# EAGLE design SO-8-normal (EAGLE 6.5.0)
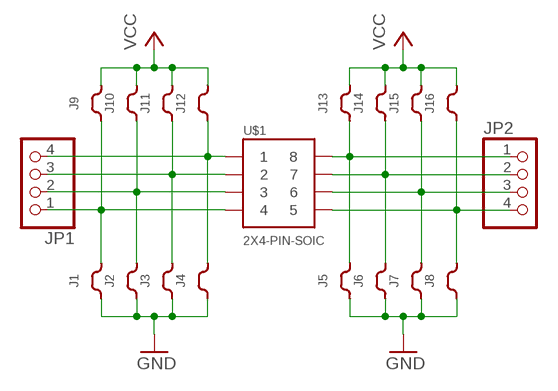
[diagram p0: schematic, sheet 1]

## Parts
J1  JUMPER-0805  [RCLJ-0805]
J2  JUMPER-0805  [RCLJ-0805]
J3  JUMPER-0805  [RCLJ-0805]
J4  JUMPER-0805  [RCLJ-0805]
J5  JUMPER-0805  [RCLJ-0805]
J6  JUMPER-0805  [RCLJ-0805]
J7  JUMPER-0805  [RCLJ-0805]
J8  JUMPER-0805  [RCLJ-0805]
J9  JUMPER-0603  [RCLJ-0603]
J10  JUMPER-0603  [RCLJ-0603]
J11  JUMPER-0603  [RCLJ-0603]
J12  JUMPER-0603  [RCLJ-0603]
J13  JUMPER-0603  [RCLJ-0603]
J14  JUMPER-0603  [RCLJ-0603]
J15  JUMPER-0603  [RCLJ-0603]
J16  JUMPER-0603  [RCLJ-0603]
JP1  PINHD-1X4  [1X04]
JP2  PINHD-1X4  [1X04]
U$1  2X4-PIN-SOIC  [SO8]

## Nets
1: J4.2 J12.1 JP1.4 U$1.P$1
2: J3.2 J11.1 JP1.3 U$1.P$2
3: J2.2 J10.1 JP1.2 U$1.P$3
4: J1.2 J9.1 JP1.1 U$1.P$4
5: J8.2 J16.1 JP2.4 U$1.P$5
6: J7.2 J15.1 JP2.3 U$1.P$6
7: J6.2 J14.1 JP2.2 U$1.P$7
8: J5.2 J13.1 JP2.1 U$1.P$8
GND: J1.1 J2.1 J3.1 J4.1 J5.1 J6.1 J7.1 J8.1
VCC: J9.2 J10.2 J11.2 J12.2 J13.2 J14.2 J15.2 J16.2

## Library data of the parts
J1-J16 = p.peter-rcl:JUMPER
JP1 JP2 = pinhead:PINHD-1X4: PIN HEADER
U$1 = p.peter-pacakages:2X4-PIN

## Board
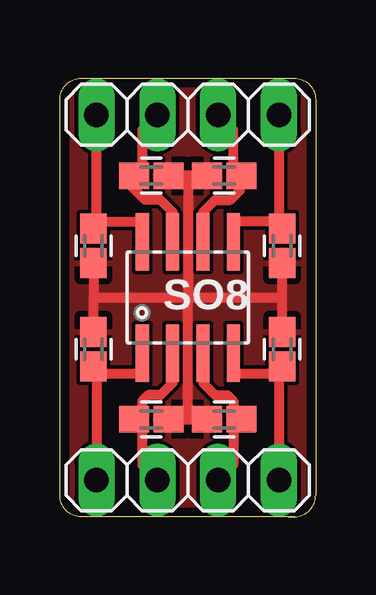
[diagram p1: board, top side]
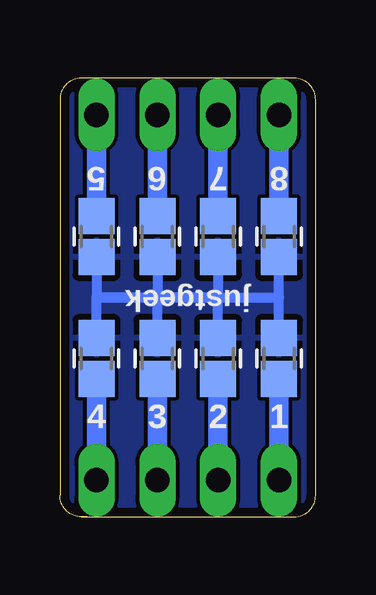
[diagram p2: board, bottom side, seen from below]

Size 10.67 x 18.29 mm. Coordinates in mm from the lower left corner, seen from the top.
Outline: 0,0.89 0,1.02
Outline: 0,1.02 0,17.4 arc-90 0.89,18.29
Outline: 0.89,18.29 1.02,18.29
Outline: 1.02,18.29 9.78,18.29 arc-90 10.67,17.4 10.67,0.89 arc-90 9.78,0
Outline: 9.78,0 9.53,0
Outline: 9.53,0 1.14,0
Outline: 1.14,0 0.89,0
Outline: 0.89,18.29 1.02,18.29
Outline: 9.53,0 9.78,0
Outline: 1.14,0 0.89,0
Outline: 0.89,0 arc-90 0,0.89
Outline: 0,0.89 0,1.02
Copper layers (1*16): Top 0.0356mm / dielectric 1.5011mm / Bottom 0.0356mm
Design rules "oshpark": minimum track width 6mil, minimum drill 13mil, track to track 6mil, track to pad 6mil, pad to pad 6mil, via to via 6mil, smd to smd 6mil, copper to edge 15mil, drill to drill 6mil, minimum pad ring 7mil, minimum via ring 7mil, stop-mask expansion 4mil, vias tented up to drill 4.1mm, thermal gap 10mil

### Footprints (pad centres in the part's own frame; a part is rotated, then mirrored left to right if it is on the bottom)
RCLJ-0805 = smd 1.5 x 1.5: 1 -0.85,0; 2 0.85,0
RCLJ-0603 = smd 1.25 x 1.1: 1 -0.725,0; 2 0.725,0
1X04 = drill 1.016 long: 1 -3.81,0; 2 -1.27,0; 3 1.27,0; 4 3.81,0
SO8 = smd 0.559 x 2.413: P$1 -1.905,-2.324; P$2 -0.635,-2.324; P$3 0.635,-2.324; P$4 1.905,-2.324; P$5 1.905,2.324; P$6 0.635,2.324; P$7 -0.635,2.324; P$8 -1.905,2.324

### Placement (x,y rotation side)
J1  9.14,6.6 270 bottom
J2  6.6,6.6 270 bottom
J3  4.06,6.6 270 bottom
J4  1.52,6.6 270 bottom
J5  1.52,11.68 90 bottom
J6  4.06,11.68 90 bottom
J7  6.6,11.68 90 bottom
J8  9.14,11.68 90 bottom
J9  9.27,6.99 90 top
J10  6.86,4.06 180 top
J11  3.81,4.06 0 top
J12  1.4,6.99 90 top
J13  1.4,11.3 270 top
J14  3.81,14.22 0 top
J15  6.86,14.22 180 top
J16  9.27,11.3 270 top
JP1  5.33,1.52 180 top
JP2  5.33,16.76 0 top
U$1  5.33,9.14 0 top

### Tracks (layer width: path | path; a pad name or v marks a point on that pad's centre or on a via)
1
  Top 0.406: J12.1 1.4,5.97 | 1.4,5.97 1.52,5.97 | 1.52,5.97 3.43,5.97 U$1.P$1 | 1.4,5.97 1.52,5.97 | 1.52,5.97 1.52,1.78 JP1.4
  Bottom 0.813: JP1.4 J4.2
2
  Top 0.406: J11.1 3.43,4.06 3.43,3.56 | 3.43,3.56 3.43,2.16 JP1.3 | U$1.P$2 4.7,5.59 4.19,5.08 3.68,5.08 3.43,4.83 3.43,3.56
  Bottom 0.813: JP1.3 J3.2
3
  Top 0.406: J10.1 7.24,4.06 | 7.24,4.06 7.24,2.16 JP1.2 | U$1.P$3 5.97,5.59 6.48,5.08 6.99,5.08 7.24,4.83 7.24,4.06
  Bottom 0.813: JP1.2 J2.2
4
  Top 0.406: U$1.P$4 7.24,5.97 | 7.24,5.97 7.24,5.84 7.24,5.97 | 7.24,5.97 9.14,5.97 | 9.14,5.97 9.27,5.97 | 9.27,5.97 J9.1 | 9.27,5.97 9.14,5.97 | 9.14,5.97 9.14,1.65 JP1.1
  Bottom 0.813: JP1.1 J1.2
5
  Top 0.406: JP2.4 9.14,12.45 | 9.14,12.45 9.14,12.32 7.24,12.32 U$1.P$5 | J16.1 9.27,12.32 9.14,12.45
  Bottom 0.813: J8.2 JP2.4
6
  Top 0.406: JP2.3 7.24,16.13 7.24,14.1 J15.1 7.49,14.01 7.49,13.59 7.11,13.21 6.48,13.21 5.97,12.7 U$1.P$6
  Bottom 0.813: J7.2 JP2.3
7
  Top 0.406: U$1.P$7 4.7,12.7 4.19,13.21 3.56,13.21 3.05,13.72 3.05,14.06 J14.1 3.43,14.1 3.43,16.13 JP2.2
  Bottom 0.813: J6.2 JP2.2
8
  Top 0.406: J13.1 1.4,12.32 | 1.4,12.32 1.52,12.32 | 1.52,12.32 3.43,12.32 U$1.P$8 | 1.4,12.32 1.52,12.32 | 1.52,12.32 JP2.1
  Bottom 0.813: J5.2 JP2.1
GND
  Bottom 0.406: J3.1 4.06,9.14 | 4.06,9.14 6.6,9.14 | 6.6,9.14 9.14,9.14 | 9.14,9.14 6.6,9.14 | 6.6,9.14 4.06,9.14 | 4.06,9.14 1.52,9.14 | 1.52,9.14 J5.1 | J7.1 6.6,9.14 | J2.1 6.6,9.14 | J1.1 9.14,9.14 | J8.1 9.14,9.14 | J6.1 4.06,9.14 | J4.1 1.52,9.14
  pour Bottom (isolate 0.152): 0,0 10.67,0 10.67,18.29 0,18.29
VCC
  Top 0.406: J13.2 1.4,9.14 | 1.4,9.14 5.33,9.14 | 5.33,9.14 9.27,9.14 | 9.27,9.14 J16.2 | J15.2 5.33,14.22 | 5.33,14.22 J14.2 5.33,14.22 | 5.33,14.22 5.33,9.14 | J11.2 5.33,4.06 | 5.33,4.06 J10.2 5.33,4.06 | 5.33,4.06 5.33,9.14 | J12.2 1.4,9.14 | J9.2 9.27,9.14
  pour Top (isolate 0.152): 0,0 10.67,0 10.67,18.29 0,18.29

### Text on the board
tPlace: SO8
bPlace: 8 | 7 | 6 | 5 | justgeek | 1 | 2 | 3 | 4